# Altium project SI4468.PrjPcb
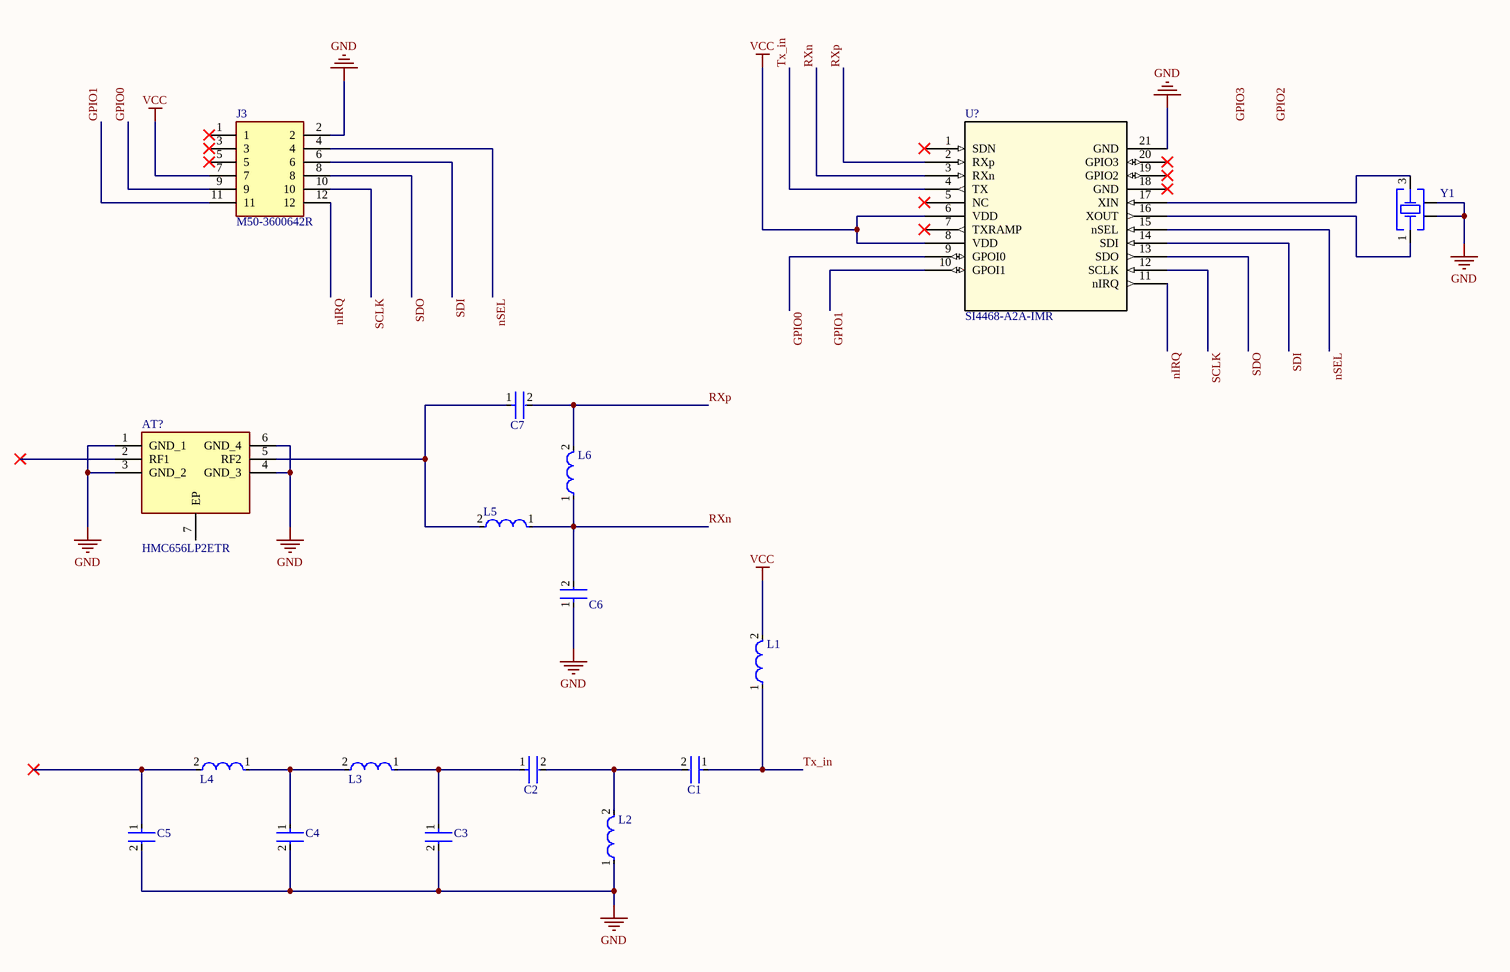
[diagram p0: SI4468.SchDoc]
1 sheet, 17 parts. Net scope: global (net labels, ports and power ports of the same name join across sheets).
Board file: SI4468.PcbDoc

## Sheet SI4468.SchDoc
size A3

### Parts
AT1  HMC656LP2ETR  [SON65P200X200X100-7N]
C1  GRM21A5C2E102FWA1J  [FP-GRM21A-0_2-MFG]  (value not drawn)
C2  GRM21A5C2J120FWA1D  [FP-GRM21A-0_2-MFG]  (value not drawn)
C3  GQM2195C2E300GB12D  [FP-GRM21A-0_2-MFG]  (value not drawn)
C4  GQM2195C2E430GB12D  [FP-GRM21A-0_2-MFG]  (value not drawn)
C5  GQM2195C2E300GB12D  [FP-GRM21A-0_2-MFG]  (value not drawn)
C6  GRM21A5C2J120FWA1D  [FP-GRM21A-0_2-MFG]  (value not drawn)
C7  GQM2195C2E5R6CB12D  [FP-GRM21A-0_2-MFG]  (value not drawn)
J3  M50-3600642R  [M50-3600642R]
L1  LQW2UAS1R0F00L  [FP-LQW2UAS_00-MFG]  (value not drawn)
L2  LQW2UAS56NF00L  [FP-LQW2UAS_00-MFG]  (value not drawn)
L3  LQW2BAS56NG00L  [FP-LQW2BAN_00-MFG]  (value not drawn)
L4  LQW2BAS56NG00L  [FP-LQW2BAN_00-MFG]  (value not drawn)
L5  LQW2BASR15G00L  [FP-LQW2BAN_00-MFG]  (value not drawn)
L6  LQW2BASR24G00L  [FP-LQW2BAN_00-MFG]  (value not drawn)
U1  SI4468-A2A-IMR  [QFN20_Si44687_SIL]
Y1  830107284409  [WE-XTAL_CFPX-218]  (value not drawn)

### Nets
GND: AT1.1(GND_1) AT1.3(GND_2) AT1.4(GND_3) AT1.6(GND_4) C3.2 C4.2 C5.2 C6.1 J3.2 L2.1 U1.21(GND) Y1.2(GND) Y1.4(GND)
VCC: J3.7 L1.2 U1.6(VDD) U1.8(VDD)
GPIO0: J3.9 U1.9(GPOI0)
GPIO1: J3.11 U1.10(GPOI1)
nIRQ: J3.12 U1.11(nIRQ)
nSEL: J3.4 U1.15(nSEL)
RXn: C6.2 L5.1 L6.1 U1.3(RXn)
RXp: C7.2 L6.2 U1.2(RXp)
SCLK: J3.10 U1.12(SCLK)
SDI: J3.6 U1.14(SDI)
SDO: J3.8 U1.13(SDO)
Tx_in: C1.1 L1.1 U1.4(TX)
NetAT1_5: AT1.5(RF2) C7.1 L5.2
NetC1_2: C1.2 C2.2 L2.2
NetC2_1: C2.1 C3.1 L3.1
NetC4_1: C4.1 L3.2 L4.1
NetC5_1: C5.1 L4.2
NetU1_16: U1.16(XOUT) Y1.1(Crystal)
NetU1_17: U1.17(XIN) Y1.3(Crystal)

Not connected (* = marked no-connect by the designer): AT1 2(RF1)* 7(EP); J3 1* 3* 5*; U1 1(SDN)* 5(NC)* 7(TXRAMP)* 18(GND)* 19(GPIO2)* 20(GPIO3)*

### Notes on the sheet
- Labels drawn without touching a wire or pin: GPIO2, GPIO3

### Library data of the parts
AT1 = HMC656LP2ETR: Attenuator or Isolator; Manufacturer_Name: Analog Devices; Datasheet Link: https://www.analog.com/media/en/technical-documentation/data-sheets/hmc656lp2-hmc658lp2.pdf; Height: 1mm; Manufacturer_Part_Number: HMC656LP2ETR; Mouser Part Number: 584-HMC656LP2ETR; Mouser Price/Stock: https://www.mouser.co.uk/ProductDetail/Analog-Devices/HMC656LP2ETR?qs=3izLlwrMQ7khzsLKjIESFw%3D%3D; Arrow Part Number: HMC656LP2ETR; Arrow Price/Stock: https://www.arrow.com/en/products/hmc656lp2etr/analog-devices
C1-C7 = CMP-06035-012030-1: Chip Multilayer Ceramic Capacitors for General Purpose, 0805, 1000pF, C0G, 30ppm/°C, 1%, 250V
J3 = M50-3600642R: Connector; Manufacturer_Name: Harwin; Datasheet Link: https://cdn.harwin.com/pdfs/M50-360R.pdf; Manufacturer_Part_Number: M50-3600642R
L1 = CMP-06042-008432-1: Wire Wound RF Inductor 1000nH ±1% 370mA 1.75Ω 1008 (2520); Test Frequency: 25MHz; Self Resonant Frequency: 290MHz; Core Material: Non-Magnetic; Inductance: 1uH; Shielding: Unshielded; DC Resistance (DCR): 1.75R; Mount: Surface Mount; Resistor Type: Wirewound; Tolerance: 1%; Current Rating: 370mA; Case/Package: 1008; Min Operating Temperature: -55°C; Max Operating Temperature: 125°C; Packaging: Cut Tape
L2 = CMP-06042-009211-1: Wire Wound RF Inductor 56nH ±1% 1000mA 0.18Ω 1008 (2520)
L3 L4 = CMP-06042-001883-1: Wire Wound RF Inductor 56nH ±2% 500mA 0.34Ω 0805 (2015); Shielding: Unshielded; DC Resistance (DCR): 340mR; Test Frequency: 200MHz; Self Resonant Frequency: 1.6GHz; Width: 0.06inch; Min Operating Temperature: -40°C; Inductance: 56nH; Mount: Surface Mount; Packaging: Tape and Reel; Resistor Type: Wirewound; Max Operating Temperature: 85°C; Package Quantity: 2000; Current Rating: 500mA; Case/Package: 0805; Length: 0.082inch; Height - Seated (Max): 0.061inch; Tolerance: 2%
L5 = CMP-06042-011202-1: Wire Wound RF Inductor 150nH ±2% 400mA 0.56Ω 0805 (2015); Test Frequency: 100MHz; Shielding: Unshielded; Self Resonant Frequency: 920MHz; DC Resistance (DCR): 560mR; Inductance: 150nH; Height - Seated (Max): 0.061inch; Packaging: Tape and Reel; Width: 0.06inch; Length: 0.082inch; Resistor Type: Wirewound; Min Operating Temperature: -40°C; Mount: Surface Mount; Current Rating: 400mA; Tolerance: 2%; Case/Package: 0805; Package Quantity: 2000; Max Operating Temperature: 85°C
L6 = CMP-06042-000501-1: Wire Wound RF Inductor 240nH ±2% 350mA 1Ω 0805 (2015); Test Frequency: 100MHz; Shielding: Unshielded; Self Resonant Frequency: 770MHz; DC Resistance (DCR): 1R; Max Operating Temperature: 85°C; Resistor Type: Wirewound; Min Operating Temperature: -40°C; Mount: Surface Mount; Packaging: Tape and Reel; Height - Seated (Max): 0.061inch; Width: 0.06inch; Package Quantity: 2000; Inductance: 240nH; Length: 0.082inch; Current Rating: 350mA; Case/Package: 0805; Tolerance: 2%
U1 = SI4468-A2A-IMR: No Description Available; Mfr_Name: Silicon Labs; RefDes: RefDes; Type: Type
Y1 = 830107284409: WE-XTAL Quartz Crystal, SMT, CFPX-218, 30MHz, +/-10ppm; Manufacturer: Wurth Elektronik; Load Capacitance: 10pF; ComponentLink1Description: Website Link; ComponentLink1URL: https://www.we-online.com/redexpert/article/830107284409?ad; ComponentLink2Description: Datasheet Link; ComponentLink2URL: https://www.we-online.com/redexpert/spec/830107284409?ad; Manufacturer Part Number: 830107284409; Category: Crystals; Match Code: WE-XTAL; Mount: Surface Mount; Operating Temperature Max: 70°C; Operating Temperature Min: -20°C; Packaging: Tape and Reel; Case/Size Code: CFPX-218; Length: 2.5mm; Width: 2mm; Height: 0.6mm; Frequency: 30MHz; Frequency Stability: +/-10ppm; Frequency Tolerance: +/-10ppm